# Altium project PCB_Lab2.PrjPCB
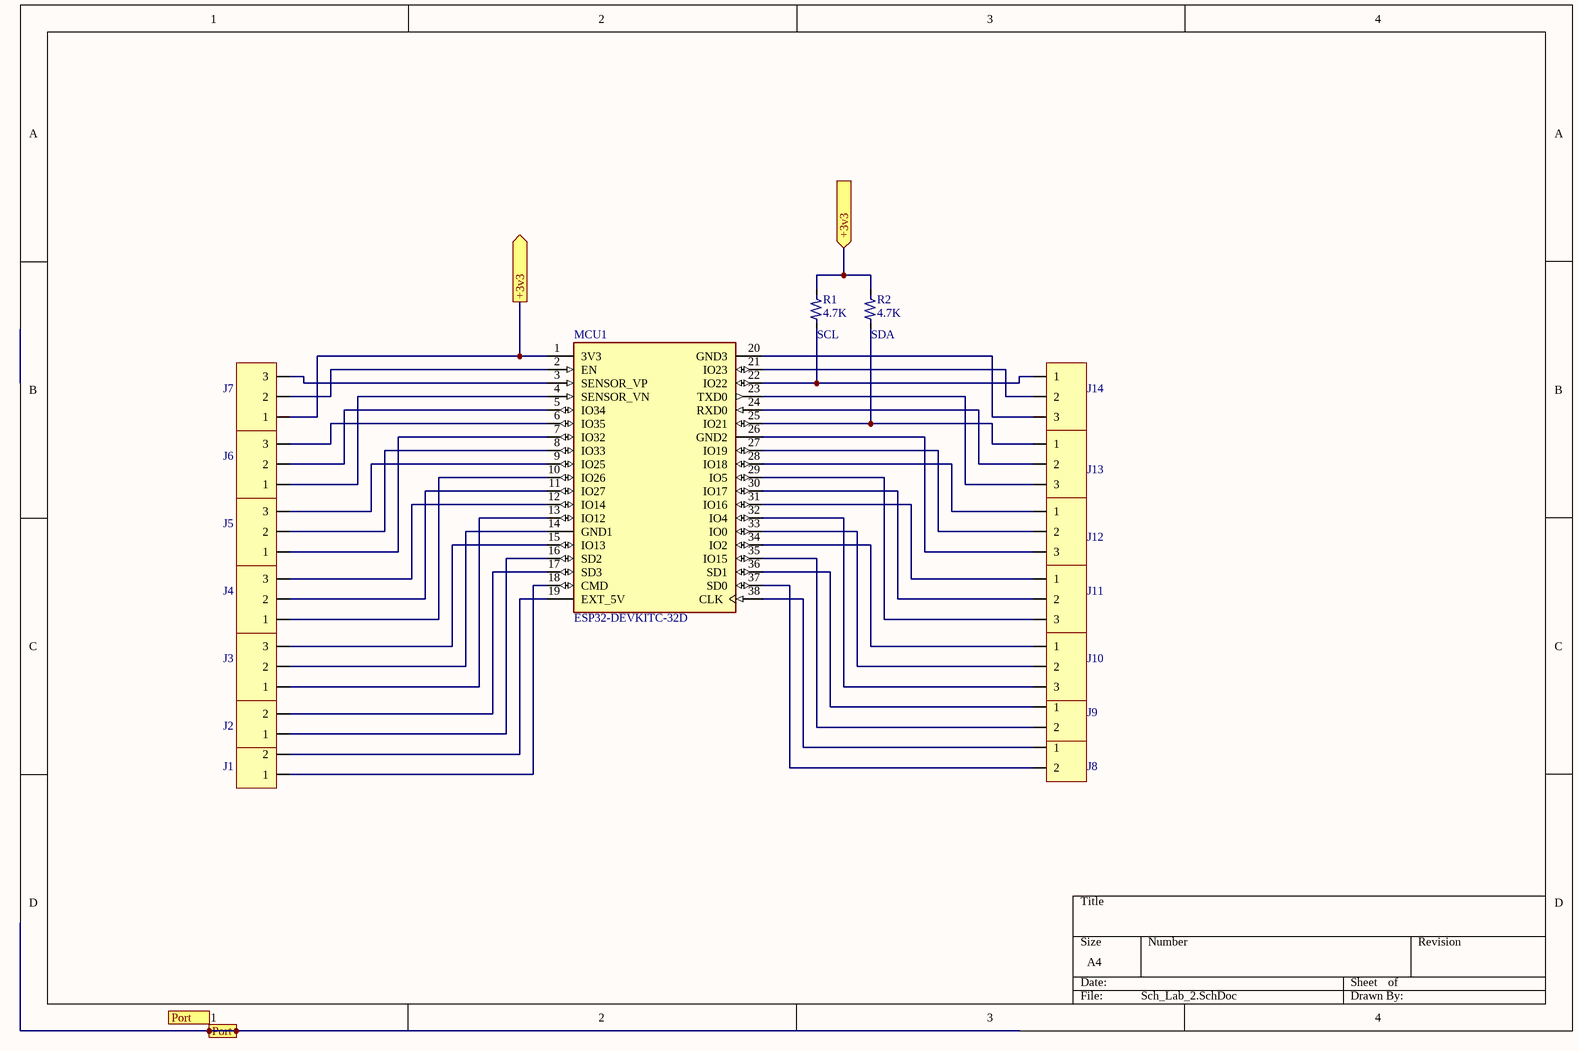
[diagram p0: Sch_Lab_2.SchDoc]
1 sheet, 17 parts. Net scope: flat (ports and power ports of the same name join across sheets).
Board files: PCB1_Lab2.PcbDoc, PCB1 MK2.PcbDoc

## Sheet Sch_Lab_2.SchDoc
size A4

### Parts
J1  (no value)  [TB_200Mil 2 P]
J2  (no value)  [TB_200Mil 2 P]
J3  (no value)  [TB_200Mil 3 P]
J4  (no value)  [TB_200Mil 3 P]
J5  (no value)  [TB_200Mil 3 P]
J6  (no value)  [TB_200Mil 3 P]
J7  (no value)  [TB_200Mil 3 P]
J8  (no value)  [TB_200Mil 2 P]
J9  (no value)  [TB_200Mil 2 P]
J10  (no value)  [TB_200Mil 3 P]
J11  (no value)  [TB_200Mil 3 P]
J12  (no value)  [TB_200Mil 3 P]
J13  (no value)  [TB_200Mil 3 P]
J14  (no value)  [TB_200Mil 3 P]
MCU1  ESP32-DEVKITC-32D  [MODULE_ESP32-DEVKITC-32D]
R1  4.7K  [4.7K]
R2  4.7K  [4.7K]

### Ports
+3v3 (in), +3v3 (out), Port

### Nets
NetJ1_1: J1.1 MCU1.18(CMD)
NetJ1_2: J1.2 MCU1.19(EXT_5V)
NetJ2_1: J2.1 MCU1.16(SD2)
NetJ2_2: J2.2 MCU1.17(SD3)
NetJ3_1: J3.1 MCU1.13(IO12)
NetJ3_2: J3.2 MCU1.14(GND1)
NetJ3_3: J3.3 MCU1.15(IO13)
NetJ4_1: J4.1 MCU1.10(IO26)
NetJ4_2: J4.2 MCU1.11(IO27)
NetJ4_3: J4.3 MCU1.12(IO14)
NetJ5_1: J5.1 MCU1.7(IO32)
NetJ5_2: J5.2 MCU1.8(IO33)
NetJ5_3: J5.3 MCU1.9(IO25)
NetJ6_1: J6.1 MCU1.4(SENSOR_VN)
NetJ6_2: J6.2 MCU1.5(IO34)
NetJ6_3: J6.3 MCU1.6(IO35)
NetJ7_1: J7.1 MCU1.1(3V3) R1.2 R2.2 ; port +3v3
NetJ7_2: J7.2 MCU1.2(EN)
NetJ7_3: J7.3 MCU1.3(SENSOR_VP)
NetJ8_1: J8.1 MCU1.38(CLK)
NetJ8_2: J8.2 MCU1.37(SD0)
NetJ9_1: J9.1 MCU1.36(SD1)
NetJ9_2: J9.2 MCU1.35(IO15)
NetJ10_1: J10.1 MCU1.34(IO2)
NetJ10_2: J10.2 MCU1.33(IO0)
NetJ10_3: J10.3 MCU1.32(IO4)
NetJ11_1: J11.1 MCU1.31(IO16)
NetJ11_2: J11.2 MCU1.30(IO17)
NetJ11_3: J11.3 MCU1.29(IO5)
NetJ12_1: J12.1 MCU1.28(IO18)
NetJ12_2: J12.2 MCU1.27(IO19)
NetJ12_3: J12.3 MCU1.26(GND2)
NetJ13_1: J13.1 MCU1.25(IO21) R2.1
NetJ13_2: J13.2 MCU1.24(RXD0)
NetJ13_3: J13.3 MCU1.23(TXD0)
NetJ14_1: J14.1 MCU1.22(IO22) R1.1
NetJ14_2: J14.2 MCU1.21(IO23)
NetJ14_3: J14.3 MCU1.20(GND3)

### Notes on the sheet
- (near R1) SCL
- (near R2) SDA

### Library data of the parts
J1 J2 J8 J9 = TB 2 PIN
J3-J7 J10-J14 = TB 3 PIN
MCU1 = ESP32-DEVKITC-32D: EVAL BOARD FOR ESP-WROOM-32; MF: Espressif Systems; Value: *; MP: ESP32-DEVKITC-32D; Price: None; Check_prices: https://www.snapeda.com/parts/ESP32-DEVKITC-32D/Espressif%20Systems/view-part/2777395/?ref=eda; SnapEDA_Link: https://www.snapeda.com/parts/ESP32-DEVKITC-32D/Espressif%20Systems/view-part/2777395/?ref=snap; Availability: Warning; Purchase-URL: https://pricing.snapeda.com/search/part/ESP32-DEVKITC-32D/?ref=eda; Package: None